# EAGLE schematic CPU (EAGLE 9.3.0)
Raspberry Pi CM3 and Associated Components
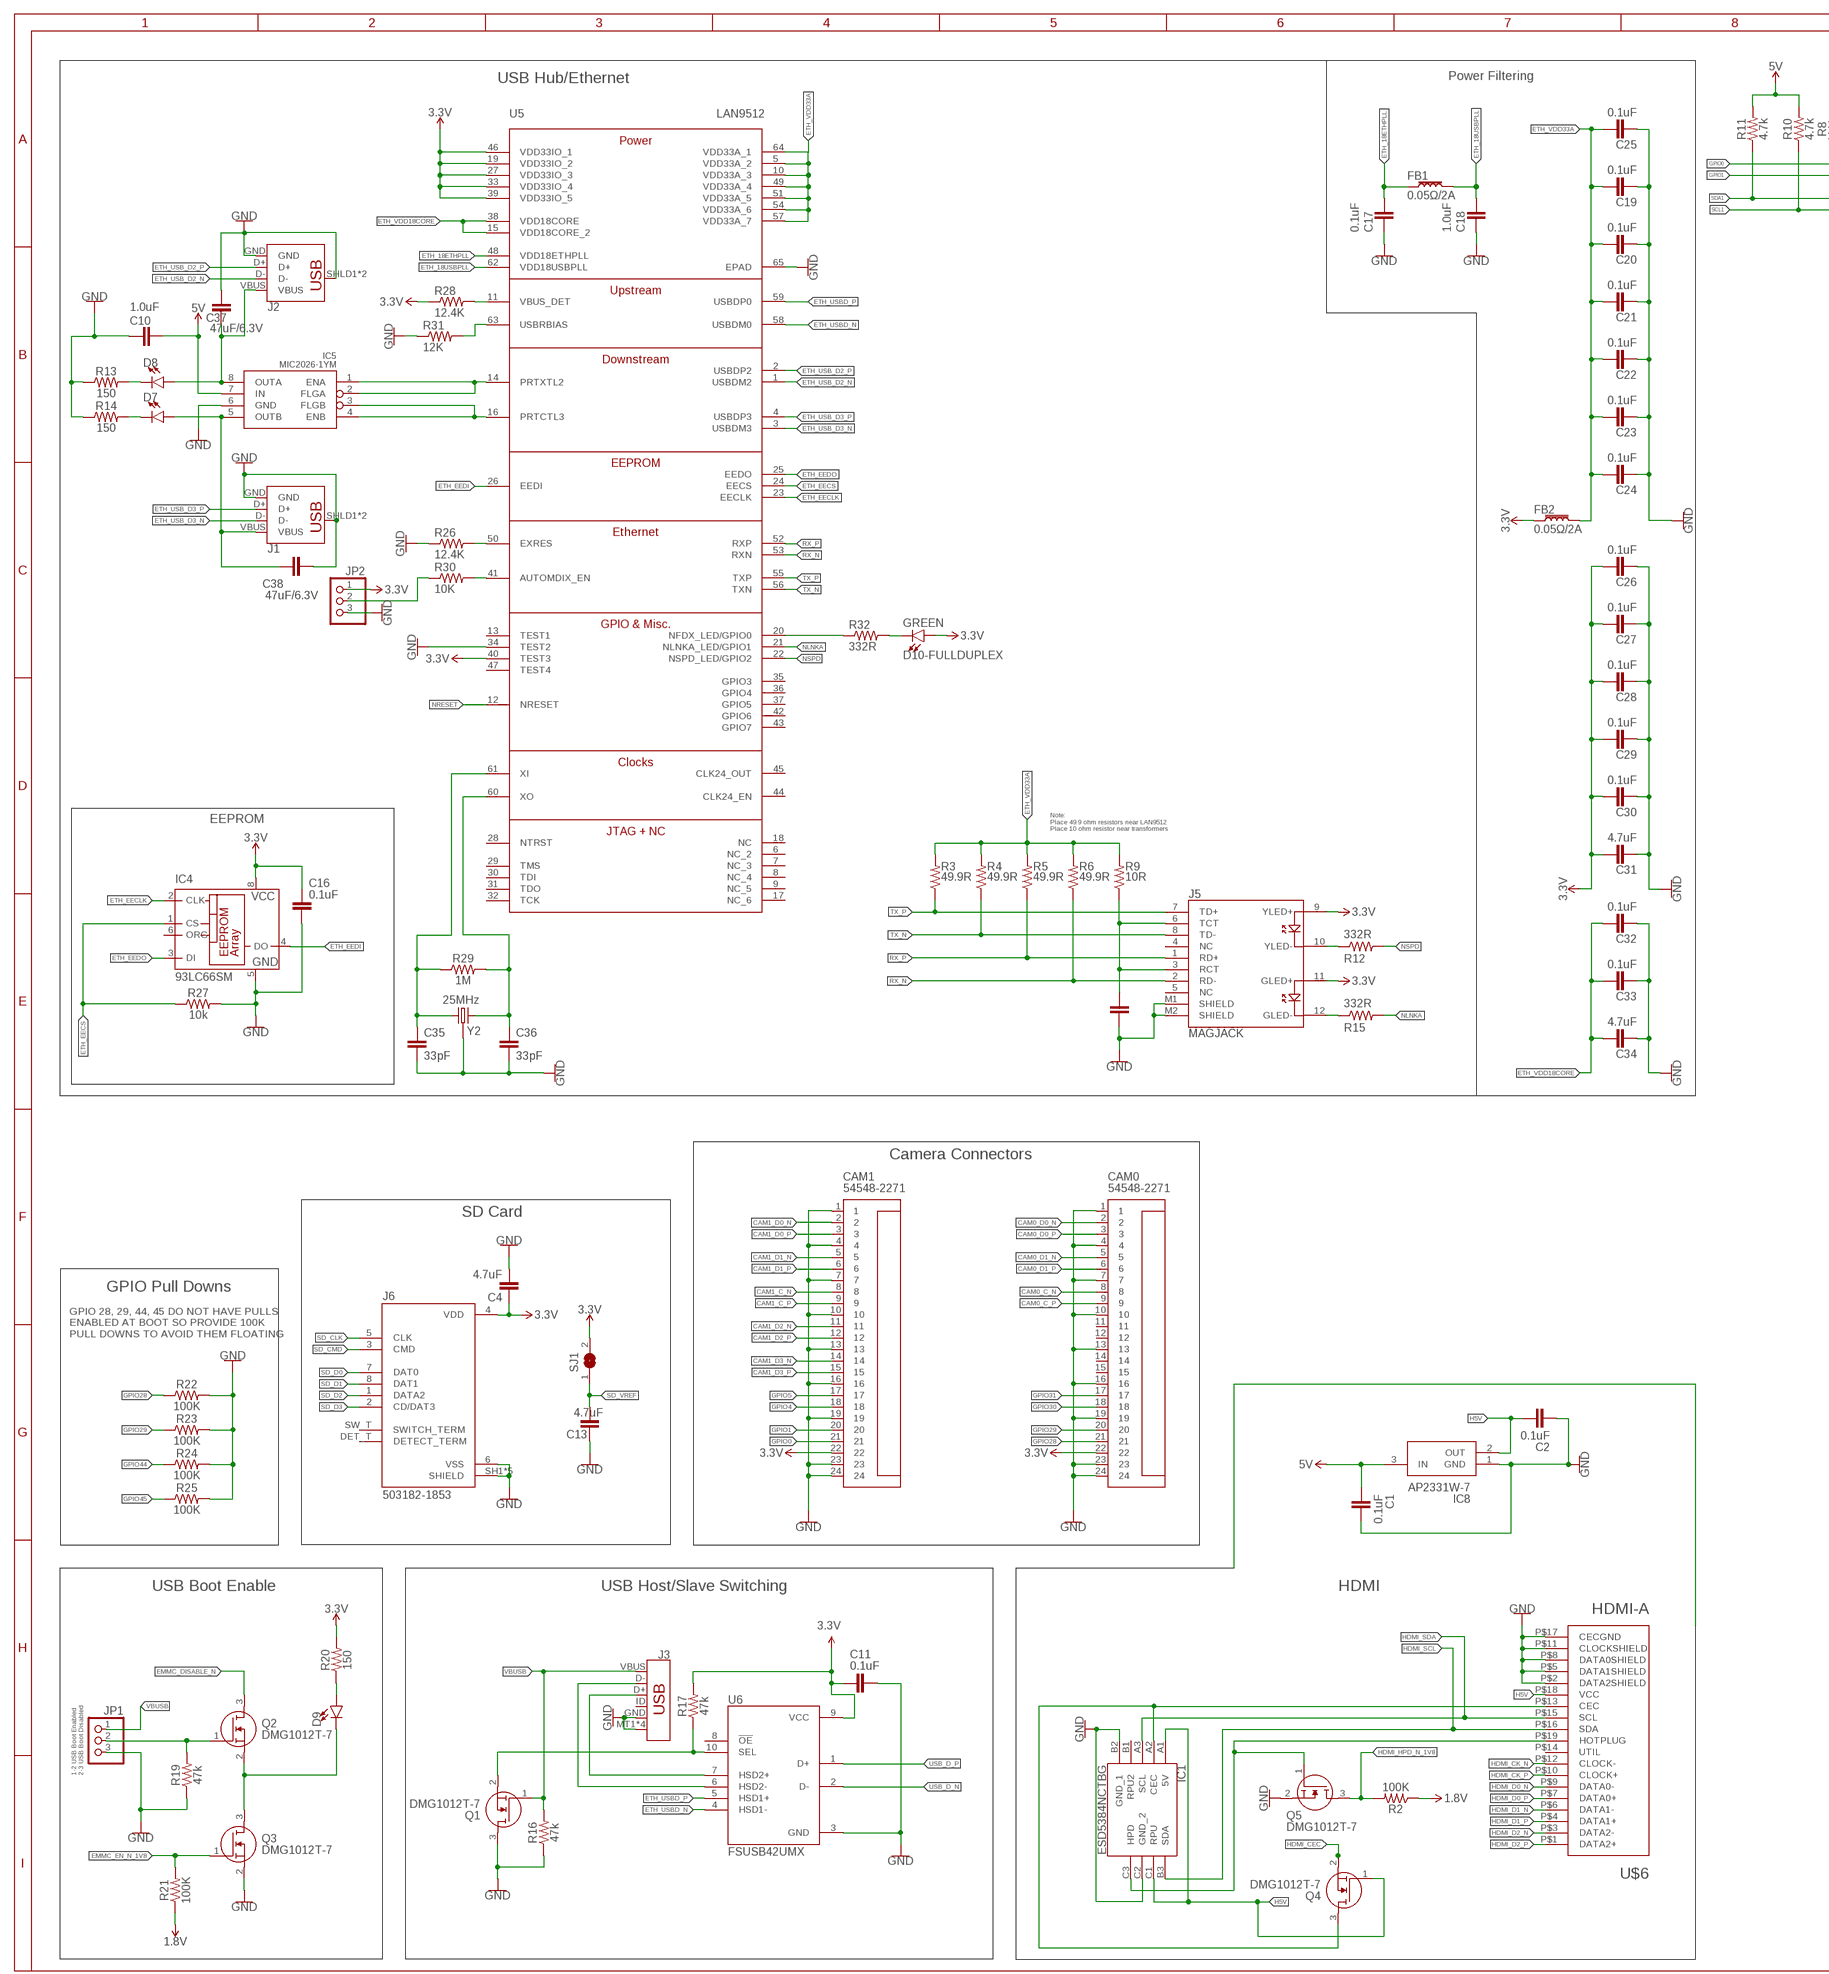
[diagram p0: schematic, sheet 1, part 1 of 2]
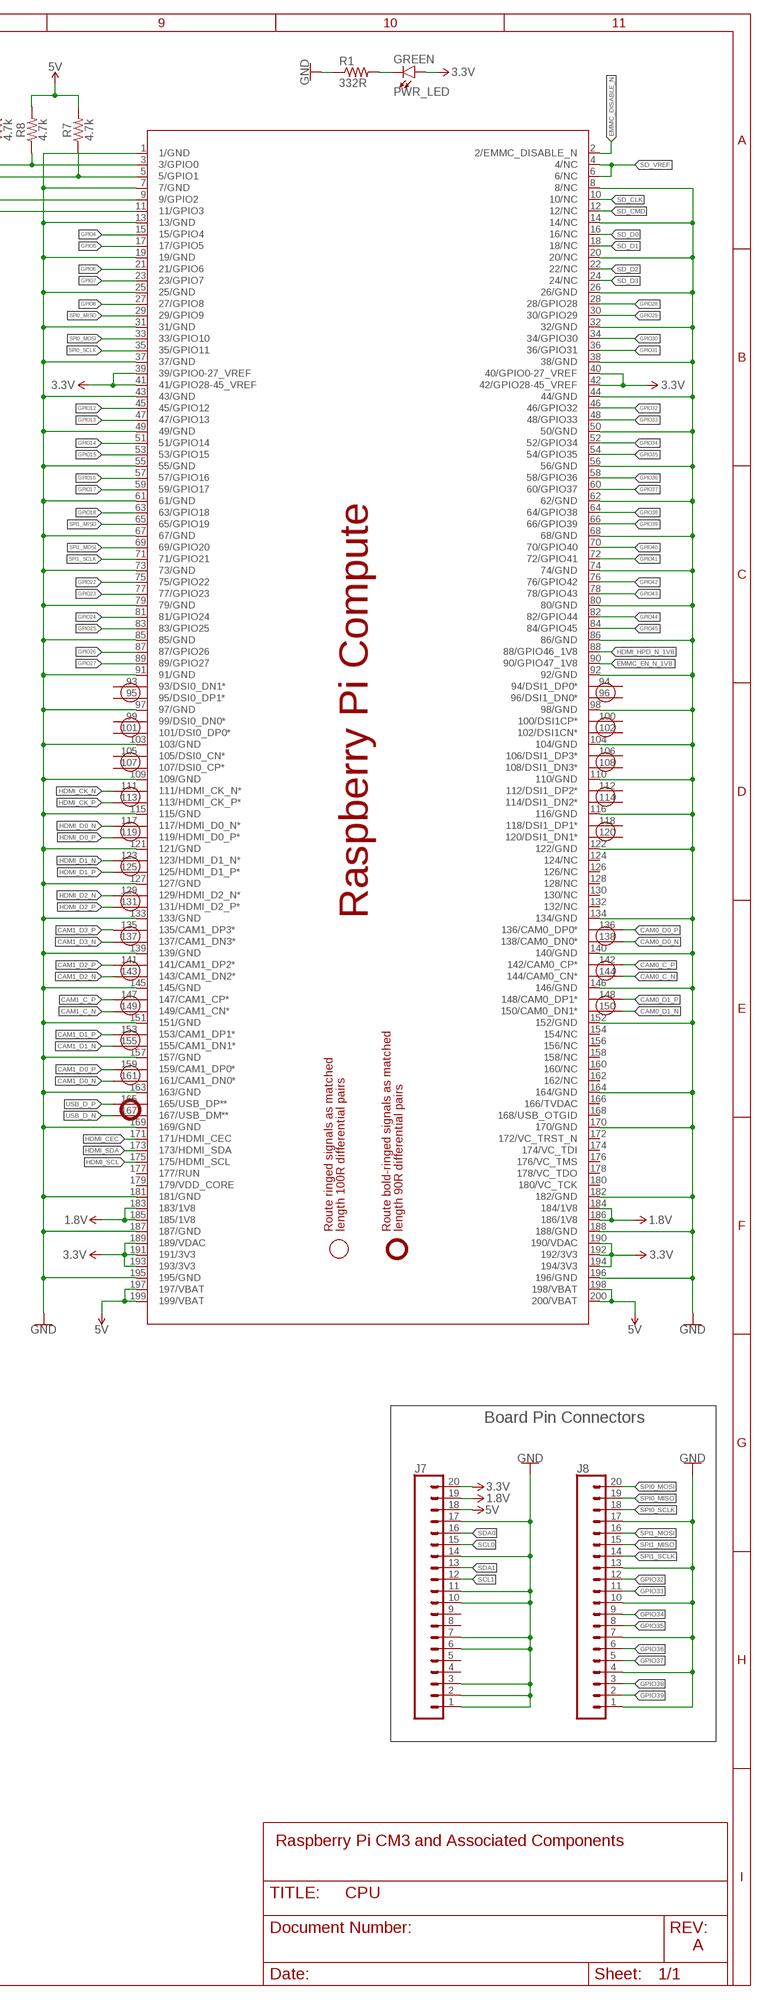
[diagram p1: schematic, sheet 1, part 2 of 2]

## Parts
C1  0.1uF  0.1UF-0402-16V-10%  [0402]
C2  0.1uF  0.1UF-0402-16V-10%  [0402]
C3  0.022uF/50V  47UF  [0805]
C4  4.7uF  4.7UF-0603-6.3V-(10%)  [0603]
C10  1.0uF  1.0UF-0402-16V-10%  [0402]
C11  0.1uF  0.1UF-0402-16V-10%  [0402]
C13  4.7uF  4.7UF-0603-6.3V-(10%)  [0603]
C16  0.1uF  0.1UF-0402-16V-10%  [0402]
C17  0.1uF  1.0UF-0402-16V-10%  [0402]
C18  1.0uF  1.0UF-0402-16V-10%  [0402]
C19  0.1uF  1.0UF-0402-16V-10%  [0402]
C20  0.1uF  1.0UF-0402-16V-10%  [0402]
C21  0.1uF  1.0UF-0402-16V-10%  [0402]
C22  0.1uF  1.0UF-0402-16V-10%  [0402]
C23  0.1uF  1.0UF-0402-16V-10%  [0402]
C24  0.1uF  1.0UF-0402-16V-10%  [0402]
C25  0.1uF  1.0UF-0402-16V-10%  [0402]
C26  0.1uF  1.0UF-0402-16V-10%  [0402]
C27  0.1uF  1.0UF-0402-16V-10%  [0402]
C28  0.1uF  1.0UF-0402-16V-10%  [0402]
C29  0.1uF  1.0UF-0402-16V-10%  [0402]
C30  0.1uF  1.0UF-0402-16V-10%  [0402]
C31  4.7uF  1.0UF-0402-16V-10%  [0402]
C32  0.1uF  1.0UF-0402-16V-10%  [0402]
C33  0.1uF  1.0UF-0402-16V-10%  [0402]
C34  4.7uF  1.0UF-0402-16V-10%  [0402]
C35  33pF  33PF-0603-50V-5%  [0603]
C36  33pF  33PF-0603-50V-5%  [0603]
C37  47uF/6.3V  47UF  [0805]
C38  47uF/6.3V  47UF  [0805]
CAM0  54548-2271  [545482271]
CAM1  54548-2271  [545482271]
CPU1  RPI_COMPUTE  [RPI_COMPUTE]
D7  GREEN  LED-GREEN0603  [LED-0603]
D8  GREEN  LED-GREEN0603  [LED-0603]
D9  GREEN  LED-GREEN0603  [LED-0603]
D10-FULLDUPLEX  GREEN  LED-GREEN0603  [LED-0603]
FB1  0.05Ω/2A  FERRITE_BEAD-0603  [0603]
FB2  0.05Ω/2A  FERRITE_BEAD-0603  [0603]
IC1  ESD5384NCTBG  [BGA9C40P3X3_114X114X63]
IC4  93LC66SM  [SO-08M]
IC5  MIC2026-1YM  [SO08]
IC8  AP2331W-7  [SOT95P285X130-3N]
J1  USB_A_SMT_FEMALE  [USB-A-S-SILK-FEMALE]
J2  USB_A_SMT_FEMALE  [USB-A-S-SILK-FEMALE]
J3  USB_MICRO-B_SMT  [USB-MICROB]
J5  MAGJACK  [MAGJACK]
J6  503182-1853  [MOLEX_503182-1853]
J7  CONN_20  [1X20]
J8  CONN_20  [1X20]
JP1  PINHD-1X3  [1X03]
JP2  PINHD-1X3  [1X03]
PWR_LED  GREEN  LED-GREEN0603  [LED-0603]
Q1  DMG1012T-7  [SOT50P160X80-3N]
Q2  DMG1012T-7  [SOT50P160X80-3N]
Q3  DMG1012T-7  [SOT50P160X80-3N]
Q4  DMG1012T-7  [SOT50P160X80-3N]
Q5  DMG1012T-7  [SOT50P160X80-3N]
R1  332R  R-US_R0603  [R0603]
R2  100K  100KOHM-0402-1/16W-1%  [0402]
R3  49.9R  R-US_R0603  [R0603]
R4  49.9R  R-US_R0603  [R0603]
R5  49.9R  R-US_R0603  [R0603]
R6  49.9R  R-US_R0603  [R0603]
R7  4.7k  4.7KOHM-0603-1/10W-1%  [0603]
R8  4.7k  4.7KOHM-0603-1/10W-1%  [0603]
R9  10R  R-US_R0603  [R0603]
R10  4.7k  4.7KOHM-0603-1/10W-1%  [0603]
R11  4.7k  4.7KOHM-0603-1/10W-1%  [0603]
R12  332R  R-US_R0603  [R0603]
R13  150  150OHM-0603-1/10W-1%  [0603]
R14  150  150OHM-0603-1/10W-1%  [0603]
R15  332R  R-US_R0603  [R0603]
R16  47k  47KOHM-0603-1/10W-1%  [0603]
R17  47k  47KOHM-0603-1/10W-1%  [0603]
R19  47k  47KOHM-0603-1/10W-1%  [0603]
R20  150  150OHM-0603-1/10W-1%  [0603]
R21  100K  100KOHM-0402-1/16W-1%  [0402]
R22  100K  100KOHM-0402-1/16W-1%  [0402]
R23  100K  100KOHM-0402-1/16W-1%  [0402]
R24  100K  100KOHM-0402-1/16W-1%  [0402]
R25  100K  100KOHM-0402-1/16W-1%  [0402]
R26  12.4K  R-US_R0603  [R0603]
R27  10k  10KOHM-0603-1/10W-1%  [0603]
R28  12.4K  R-US_R0603  [R0603]
R29  1M  1MOHM-0603-1/4W-5%  [0603]
R30  10K  R-US_R0603  [R0603]
R31  12K  R-US_R0603  [R0603]
R32  332R  R-US_R0603  [R0603]
SJ1  SJ  [SJ]
U5  LAN9512-JZX  [QFN64_9X9MC]
U6  FSUSB42UMX  [IC_FSUSB42UMX]
U$6  HDMI-A  [HDMI_A]
Y2  25MHz  CRYSTAL-GROUNDEDSMD-3.2X2.5  [CRYSTAL-SMD-3.2X2.5MM]

## Nets
1.8V [pwr]: CPU1.183(183/1V8) CPU1.184(184/1V8) CPU1.185(185/1V8) CPU1.186(186/1V8) J7.19 R2.1 R21.1
3.3V [pwr]: C4.1 C11.2 C16.1 C26.2 C27.2 C28.2 C29.2 C30.2 C31.2 CAM0.22 CAM1.22 CPU1.39(39/GPIO0-27_VREF) CPU1.40(40/GPIO0-27_VREF) CPU1.41(41/GPIO28-45_VREF) CPU1.42(42/GPIO28-45_VREF) CPU1.189(189/VDAC) CPU1.190(190/VDAC) CPU1.191(191/3V3) CPU1.192(192/3V3) CPU1.193(193/3V3) CPU1.194(194/3V3) D10-FULLDUPLEX.A FB2.1 IC4.8(VCC) J5.9(YLED+) J5.11(GLED+) J6.4(VDD) J7.20 JP2.1 PWR_LED.A R17.2 R20.2 R28.1 SJ1.2 U5.19(VDD33IO_2) U5.27(VDD33IO_3) U5.33(VDD33IO_4) U5.39(VDD33IO_5) U5.40(TEST3) U5.46(VDD33IO_1) U6.9(VCC)
5V [pwr]: C1.2 C10.2 CPU1.197(197/VBAT) CPU1.198(198/VBAT) CPU1.199(199/VBAT) CPU1.200(200/VBAT) IC5.7(IN) IC8.3(IN) J7.18 R7.2 R8.2 R10.2 R11.2
CAM0_C_N [diff pair]: CAM0.8 CPU1.144(144/CAM0_CN*)
CAM0_C_P [diff pair]: CAM0.9 CPU1.142(142/CAM0_CP*)
CAM0_D0_N [diff pair]: CAM0.2 CPU1.138(138/CAM0_DN0*)
CAM0_D0_P [diff pair]: CAM0.3 CPU1.136(136/CAM0_DP0*)
CAM0_D1_N [diff pair]: CAM0.5 CPU1.150(150/CAM0_DN1*)
CAM0_D1_P [diff pair]: CAM0.6 CPU1.148(148/CAM0_DP1*)
CAM1_C_N [diff pair]: CAM1.8 CPU1.149(149/CAM1_CN*)
CAM1_C_P [diff pair]: CAM1.9 CPU1.147(147/CAM1_CP*)
CAM1_D0_N [diff pair]: CAM1.2 CPU1.161(161/CAM1_DN0*)
CAM1_D0_P [diff pair]: CAM1.3 CPU1.159(159/CAM1_DP0*)
CAM1_D1_N [diff pair]: CAM1.5 CPU1.155(155/CAM1_DN1*)
CAM1_D1_P [diff pair]: CAM1.6 CPU1.153(153/CAM1_DP1*)
CAM1_D2_N [diff pair]: CAM1.11 CPU1.143(143/CAM1_DN2*)
CAM1_D2_P [diff pair]: CAM1.12 CPU1.141(141/CAM1_DP2*)
CAM1_D3_N [diff pair]: CAM1.14 CPU1.137(137/CAM1_DN3*)
CAM1_D3_P [diff pair]: CAM1.15 CPU1.135(135/CAM1_DP3*)
EMMC_DISABLE_N: CPU1.2(2/EMMC_DISABLE_N) Q2.3(D)
EMMC_EN_N_1V8: CPU1.90(90/GPIO47_1V8) Q3.1(G) R21.2
ETH_18ETHPLL: C17.2 FB1.1 U5.48(VDD18ETHPLL)
ETH_18USBPLL: C18.2 FB1.2 U5.62(VDD18USBPLL)
ETH_EECLK: IC4.2(CLK) U5.23(EECLK)
ETH_EECS: IC4.1(CS) R27.1 U5.24(EECS)
ETH_EEDI: IC4.4(DO) U5.26(EEDI)
ETH_EEDO: IC4.3(DI) U5.25(EEDO)
ETH_PWR2: C37.1 D8.A IC5.8(OUTA) J2.VBUS
ETH_PWR3: C38.1 D7.A IC5.5(OUTB) J1.VBUS
ETH_USB_D2_N: J2.D- U5.1(USBDM2)
ETH_USB_D2_P: J2.D+ U5.2(USBDP2)
ETH_USB_D3_N: J1.D- U5.3(USBDM3)
ETH_USB_D3_P: J1.D+ U5.4(USBDP3)
ETH_USBD_N [diff pair]: U5.58(USBDM0) U6.4(HSD1-)
ETH_USBD_P [diff pair]: U5.59(USBDP0) U6.5(HSD1+)
ETH_VDD18CORE: C32.2 C33.2 C34.2 U5.15(VDD18CORE_2) U5.38(VDD18CORE)
ETH_VDD33A: C19.2 C20.2 C21.2 C22.2 C23.2 C24.2 C25.2 FB2.2 R3.2 R4.2 R5.2 R6.2 R9.2 U5.5(VDD33A_2) U5.10(VDD33A_3) U5.49(VDD33A_4) U5.51(VDD33A_5) U5.54(VDD33A_6) U5.57(VDD33A_7) U5.64(VDD33A_1)
GND: C1.1 C2.2 C3.1 C4.2 C10.1 C11.1 C13.1 C16.2 C17.1 C18.1 C19.1 C20.1 C21.1 C22.1 C23.1 C24.1 C25.1 C26.1 C27.1 C28.1 C29.1 C30.1 C31.1 C32.1 C33.1 C34.1 C35.2 C36.2 C37.2 C38.2 CAM0.1 CAM0.4 CAM0.7 CAM0.10 CAM0.13 CAM0.16 CAM0.19 CAM0.23 CAM0.24 CAM1.1 CAM1.4 CAM1.7 CAM1.10 CAM1.13 CAM1.16 CAM1.19 CAM1.23 CAM1.24 CPU1.1(1/GND) CPU1.7(7/GND) CPU1.8(8/NC) CPU1.13(13/GND) CPU1.14(14/NC) CPU1.19(19/GND) CPU1.20(20/NC) CPU1.25(25/GND) CPU1.26(26/GND) CPU1.31(31/GND) CPU1.32(32/GND) CPU1.37(37/GND) CPU1.38(38/GND) CPU1.43(43/GND) CPU1.44(44/GND) CPU1.49(49/GND) CPU1.50(50/GND) CPU1.55(55/GND) CPU1.56(56/GND) CPU1.61(61/GND) CPU1.62(62/GND) CPU1.67(67/GND) CPU1.68(68/GND) CPU1.73(73/GND) CPU1.74(74/GND) CPU1.79(79/GND) CPU1.80(80/GND) CPU1.85(85/GND) CPU1.86(86/GND) CPU1.91(91/GND) CPU1.92(92/GND) CPU1.97(97/GND) CPU1.98(98/GND) CPU1.103(103/GND) CPU1.104(104/GND) CPU1.109(109/GND) CPU1.110(110/GND) CPU1.115(115/GND) CPU1.116(116/GND) CPU1.121(121/GND) CPU1.122(122/GND) CPU1.127(127/GND) CPU1.133(133/GND) CPU1.134(134/GND) CPU1.139(139/GND) CPU1.140(140/GND) CPU1.145(145/GND) CPU1.146(146/GND) CPU1.151(151/GND) CPU1.152(152/GND) CPU1.157(157/GND) CPU1.163(163/GND) CPU1.164(164/GND) CPU1.169(169/GND) CPU1.170(170/GND) CPU1.181(181/GND) CPU1.182(182/GND) CPU1.187(187/GND) CPU1.188(188/GND) CPU1.195(195/GND) CPU1.196(196/GND) IC1.B2(GND_1) IC1.C2(GND_2) IC4.5(GND) IC5.6(GND) IC8.1(GND) J1.GND J1.SHLD1(SHIELD) J1.SHLD2(SHIELD) J2.GND J2.SHLD1(SHIELD) J2.SHLD2(SHIELD) J3.GND J3.MT1(SHIELD) J3.MT2(SHIELD) J3.P$1(SHIELD) J3.P$2(SHIELD) J5.M1(SHIELD) J5.M2(SHIELD) J6.6(VSS) J6.SH1(SHIELD) J6.SH2(SHIELD) J6.SH3(SHIELD) J6.SH4(SHIELD) J6.SH5(SHIELD) J7.1 J7.2 J7.3 J7.6 J7.7 J7.10 J7.11 J7.14 J7.17 J8.1 J8.4 J8.7 J8.10 J8.13 J8.17 JP1.3 JP2.3 Q1.3(D) Q3.2(S) Q5.2(S) R1.1 R13.1 R14.1 R16.1 R19.1 R22.2 R23.2 R24.2 R25.2 R26.1 R27.2 R31.1 U5.34(TEST2) U5.65(EPAD) U6.3(GND) U$6.P$2(DATA2SHIELD) U$6.P$5(DATA1SHIELD) U$6.P$8(DATA0SHIELD) U$6.P$11(CLOCKSHIELD) U$6.P$17(CECGND) Y2.2 Y2.4
GPIO0: CAM1.21 CPU1.3(3/GPIO0) R8.1
GPIO1: CAM1.20 CPU1.5(5/GPIO1) R7.1
GPIO4: CAM1.18 CPU1.15(15/GPIO4)
GPIO5: CAM1.17 CPU1.17(17/GPIO5)
GPIO6: CPU1.21(21/GPIO6)
GPIO7: CPU1.23(23/GPIO7)
GPIO8: CPU1.27(27/GPIO8)
GPIO12: CPU1.45(45/GPIO12)
GPIO13: CPU1.47(47/GPIO13)
GPIO14: CPU1.51(51/GPIO14)
GPIO15: CPU1.53(53/GPIO15)
GPIO16: CPU1.57(57/GPIO16)
GPIO17: CPU1.59(59/GPIO17)
GPIO18: CPU1.63(63/GPIO18)
GPIO22: CPU1.75(75/GPIO22)
GPIO23: CPU1.77(77/GPIO23)
GPIO24: CPU1.81(81/GPIO24)
GPIO25: CPU1.83(83/GPIO25)
GPIO26: CPU1.87(87/GPIO26)
GPIO27: CPU1.89(89/GPIO27)
GPIO28: CAM0.21 CPU1.28(28/GPIO28) R22.1
GPIO29: CAM0.20 CPU1.30(30/GPIO29) R23.1
GPIO30: CAM0.18 CPU1.34(34/GPIO30)
GPIO31: CAM0.17 CPU1.36(36/GPIO31)
GPIO32: CPU1.46(46/GPIO32) J8.12
GPIO33: CPU1.48(48/GPIO33) J8.11
GPIO34: CPU1.52(52/GPIO34) J8.9
GPIO35: CPU1.54(54/GPIO35) J8.8
GPIO36: CPU1.58(58/GPIO36) J8.6
GPIO37: CPU1.60(60/GPIO37) J8.5
GPIO38: CPU1.64(64/GPIO38) J8.3
GPIO39: CPU1.66(66/GPIO39) J8.2
GPIO40: CPU1.70(70/GPIO40)
GPIO41: CPU1.72(72/GPIO41)
GPIO42: CPU1.76(76/GPIO42)
GPIO43: CPU1.78(78/GPIO43)
GPIO44: CPU1.82(82/GPIO44) R24.1
GPIO45: CPU1.84(84/GPIO45) R25.1
H5V [bga]: C2.1 IC1.A1(5V) IC1.C1(RPU) IC8.2(OUT) Q4.1(G) U$6.P$18(VCC)
HDMI_CEC: CPU1.171(171/HDMI_CEC) Q4.2(S)
HDMI_CK_N: CPU1.111(111/HDMI_CK_N*) U$6.P$12(CLOCK-)
HDMI_CK_P: CPU1.113(113/HDMI_CK_P*) U$6.P$10(CLOCK+)
HDMI_D0_N: CPU1.117(117/HDMI_D0_N*) U$6.P$9(DATA0-)
HDMI_D0_P: CPU1.119(119/HDMI_D0_P*) U$6.P$7(DATA0+)
HDMI_D1_N: CPU1.123(123/HDMI_D1_N*) U$6.P$6(DATA1-)
HDMI_D1_P: CPU1.125(125/HDMI_D1_P*) U$6.P$4(DATA1+)
HDMI_D2_N: CPU1.129(129/HDMI_D2_N*) U$6.P$3(DATA2-)
HDMI_D2_P: CPU1.131(131/HDMI_D2_P*) U$6.P$1(DATA2+)
HDMI_HPD_N_1V8: CPU1.88(88/GPIO46_1V8) Q5.3(D) R2.2
HDMI_SCL [bga]: CPU1.175(175/HDMI_SCL) IC1.B3(SDA) U$6.P$16(SDA)
HDMI_SDA [bga]: CPU1.173(173/HDMI_SDA) IC1.A3(SCL) U$6.P$15(SCL)
N$1: PWR_LED.C R1.2
N$3: C3.2 J5.3(RCT) J5.6(TCT) R9.1
N$4: R26.2 U5.50(EXRES)
N$5: R28.2 U5.11(VBUS_DET)
N$6 [bga]: IC1.C3(HPD) Q5.1(G) U$6.P$19(HOTPLUG)
N$7: C35.1 R29.1 U5.61(XI) Y2.1
N$8: C36.1 R29.2 U5.60(XO) Y2.3
N$9 [bga]: IC1.A2(CEC) Q4.3(D) U$6.P$13(CEC)
N$10: IC5.1(ENA) IC5.2(FLGA) U5.14(PRTXTL2)
N$11: IC5.3(FLGB) IC5.4(ENB) U5.16(PRTCTL3)
N$12: J5.10(YLED-) R12.1
N$13: R30.2 U5.41(AUTOMDIX_EN)
N$14: JP2.2 R30.1
N$15: J5.12(GLED-) R15.1
N$16: D8.C R13.2
N$17: D7.C R14.2
N$18 [bga]: J3.D+ U6.7(HSD2+)
N$19: Q1.2(S) R17.1 U6.10(SEL)
N$20 [bga]: J3.D- U6.6(HSD2-)
N$21: JP1.2 Q2.1(G) R19.2
N$22: D9.C Q2.2(S) Q3.3(D)
N$23: D9.A R20.1
N$24: R31.2 U5.63(USBRBIAS)
N$26: D10-FULLDUPLEX.C R32.2
N$28: R32.1 U5.20(NFDX_LED/GPIO0)
NLNKA: R15.2 U5.21(NLNKA_LED/GPIO1)
NRESET: U5.12(NRESET)
NSPD: R12.2 U5.22(NSPD_LED/GPIO2)
RX_N [diff pair]: J5.2(RD-) R6.1 U5.53(RXN)
RX_P [diff pair]: J5.1(RD+) R5.1 U5.52(RXP)
SCL0: J7.15
SCL1: CPU1.11(11/GPIO3) J7.12 R10.1
SD_CLK: CPU1.10(10/NC) J6.5(CLK)
SD_CMD: CPU1.12(12/NC) J6.3(CMD)
SD_D0: CPU1.16(16/NC) J6.7(DAT0)
SD_D1: CPU1.18(18/NC) J6.8(DAT1)
SD_D2: CPU1.22(22/NC) J6.1(DATA2)
SD_D3: CPU1.24(24/NC) J6.2(CD/DAT3)
SD_VREF: C13.2 CPU1.4(4/NC) CPU1.6(6/NC) SJ1.1
SDA0: J7.16
SDA1: CPU1.9(9/GPIO2) J7.13 R11.1
SPI0_MISO: CPU1.29(29/GPIO9) J8.19
SPI0_MOSI: CPU1.33(33/GPIO10) J8.20
SPI0_SCLK: CPU1.35(35/GPIO11) J8.18
SPI1_MISO: CPU1.65(65/GPIO19) J8.15
SPI1_MOSI: CPU1.69(69/GPIO20) J8.16
SPI1_SCLK: CPU1.71(71/GPIO21) J8.14
TX_N [diff pair]: J5.8(TD-) R4.1 U5.56(TXN)
TX_P [diff pair]: J5.7(TD+) R3.1 U5.55(TXP)
USB_D_N [diff pair]: CPU1.167(167/USB_DM**) U6.2(D-)
USB_D_P [diff pair]: CPU1.165(165/USB_DP**) U6.1(D+)
VBUSB: J3.VBUS JP1.1 Q1.1(G) R16.2
Unconnected: CAM0.11 CAM0.12 CAM0.14 CAM0.15 CPU1.93(93/DSI0_DN1*) CPU1.94(94/DSI1_DP0*) CPU1.95(95/DSI0_DP1*) CPU1.96(96/DSI1_DN0*) CPU1.99(99/DSI0_DN0*) CPU1.100(100/DSI1CP*) CPU1.101(101/DSI0_DP0*) CPU1.102(102/DSI1CN*) CPU1.105(105/DSI0_CN*) CPU1.106(106/DSI1_DP3*) CPU1.107(107/DSI0_CP*) CPU1.108(108/DSI1_DN3*) CPU1.112(112/DSI1_DP2*) CPU1.114(114/DSI1_DN2*) CPU1.118(118/DSI1_DP1*) CPU1.120(120/DSI1_DN1*) CPU1.124(124/NC) CPU1.126(126/NC) CPU1.128(128/NC) CPU1.130(130/NC) CPU1.132(132/NC) CPU1.154(154/NC) CPU1.156(156/NC) CPU1.158(158/NC) CPU1.160(160/NC) CPU1.162(162/NC) CPU1.166(166/TVDAC) CPU1.168(168/USB_OTGID) CPU1.172(172/VC_TRST_N) CPU1.174(174/VC_TDI) CPU1.176(176/VC_TMS) CPU1.177(177/RUN) CPU1.178(178/VC_TDO) CPU1.179(179/VDD_CORE) CPU1.180(180/VC_TCK) IC1.B1(RPU2) IC4.6(ORG) IC4.7(NU) J3.ID J5.4(NC) J5.5(NC) J6.DET_T(DETECT_TERM) J6.SW_T(SWITCH_TERM) J7.4 J7.5 J7.8 J7.9 U5.6(NC_2) U5.7(NC_3) U5.8(NC_4) U5.9(NC_5) U5.13(TEST1) U5.17(NC_6) U5.18(NC) U5.28(NTRST) U5.29(TMS) U5.30(TDI) U5.31(TDO) U5.32(TCK) U5.35(GPIO3) U5.36(GPIO4) U5.37(GPIO5) U5.42(GPIO6) U5.43(GPIO7) U5.44(CLK24_EN) U5.45(CLK24_OUT) U5.47(TEST4) U6.8(!OE) U$6.P$14(UTIL)

## Notes on the sheet
- Power Filtering
- USB Hub/Ethernet
- LAN9512
- EEPROM
- Note:
  Place 49.9 ohm resistors near LAN9512
  Place 10 ohm resistor near transformers
- Camera Connectors
- SD Card
- GPIO Pull Downs
- GPIO 28, 29, 44, 45 DO NOT HAVE PULLS
  ENABLED AT BOOT SO PROVIDE 100K 
  PULL DOWNS TO AVOID THEM FLOATING
- Board Pin Connectors
- USB Boot Enable | USB Host/Slave Switching | HDMI
- 1-2 USB Boot Enabled
  2-3 USB Boot Disabled
- Raspberry Pi CM3 and Associated Components
- A

## Library data of the parts
C1 C2 C11 C16 = SparkFun-Capacitors:0.1UF: 0.1µF ceramic capacitors A capacitor is a passive two-terminal electrical component used to store electrical energy temporarily in an electric field.; PROD_ID: CAP-12416
C3 = SparkFun-Capacitors:47UF; PROD_ID: CAP-13854; VALUE: 47uF/6.3V
C4 C13 = SparkFun-Capacitors:4.7UF: 4.7µF ceramic capacitors A capacitor is a passive two-terminal electrical component used to store electrical energy temporarily in an electric field.; PROD_ID: CAP-08280
C10 C18 = SparkFun-Capacitors:1.0UF: 1µF ceramic capacitors A capacitor is a passive two-terminal electrical component used to store electrical energy temporarily in an electric field.; PROD_ID: CAP-12417
C17 C19-C34 = SparkFun-Capacitors:1.0UF: 1µF ceramic capacitors A capacitor is a passive two-terminal electrical component used to store electrical energy temporarily in an electric field.; PROD_ID: CAP-12417; VALUE: 1.0uF
C35 C36 = SparkFun-Capacitors:33PF: 33pF ceramic capacitors A capacitor is a passive two-terminal electrical component used to store electrical energy temporarily in an electric field.; PROD_ID: CAP-10142
C37 C38 = SparkFun-Capacitors:47UF; PROD_ID: CAP-13854
CAM0 CAM1 = SamacSys_Parts:54548-2271: FFC & FPC Connectors 0.5 FPC ZIF Hsg Assy ssy 22Ckt EmbsTp Pkg Source: Datasheet <https://componentsearchengine.com/Datasheets/1/54548-2271.pdf>; DESCRIPTION: FFC & FPC Connectors 0.5 FPC ZIF Hsg Assy ssy 22Ckt EmbsTp Pkg; HEIGHT: 1mm; MANUFACTURER_NAME: Molex; MANUFACTURER_PART_NUMBER: 54548-2271; MOUSER_PART_NUMBER: 538-54548-2271
CPU1 = e14_Rpi_Compute_RevC:RPI_COMPUTE: Device for a Raspberry PI Compute module. Note that the package is for a DDR2 connector of 'standard' orientation. Example: TE Connectivity P/N: 1565917-4, Newark P/N: 08P0616, Farnell P/N: 2112525 More information is available at http://www.element14.com/community/community/raspberry-pi/raspberry-pi-compute-module
D7-D9 D10-FULLDUPLEX PWR_LED = SparkFun-LED:LED-GREEN: Green SMD LED Used in manufacturing of various products at SparkFun Packages: 0603 - SMD 0603 package [Product Link] <http://www.futureelectronics.com/en/technologies/semiconductors/optoelectronics/leds/Pages/9894312-LTST-C190GKT.aspx?CrossPart=HSMG-C190&IM=0> LilyPad 1206 - SMD1206 LilyPad package [Product Link] <http://www.futureelectronics.com/en/Technologies/Product.aspx?ProductID=IN150NGHARVATEKCORPORATION2049943&IM=0> 1206 - SMD1206 package [Product Link] <http://www.futureelectronics.com/en/technologies/semiconductors/optoelectronics/leds/Pages/8315665-LTST-C150KGKT.aspx?IM=0> 1206 Bottom Mount -SMD 1206 Bottom Mount [Product Link] <http://www.digikey.com/product-detail/en/lite-on-inc/LTST-C230KGKT/160-1456-1-ND/386854> SparkFun Products: Pro Mini 328 -5V <https://www.sparkfun.com/products/821> RedBoard <https://www.sparkfun.com/products/12757> MP3 Trigger <https://www.sparkfun.com/products/13720> Makey Makey <https://www.sparkfun.com/products/11076>; PROD_ID: DIO-00821
FB1 FB2 = SparkFun-Coils:FERRITE_BEAD: Ferrite Bead (blocks, cores, rings, chokes, etc.) Inductor with layers of ferrite used to suppress high frequencies. Often used to isolate high frequency noise. SparkFun Products: IOIO-OTG - V2.2 <https://www.sparkfun.com/products/13613> SparkFun SAMD21 Mini Breakout <https://www.sparkfun.com/products/13664> SparkFun 6 Degrees of Freedom Breakout - LSM6DS3 <https://www.sparkfun.com/products/13339> SparkFun SAMD21 Dev Breakout <https://www.sparkfun.com/products/13672>; PROD_ID: NDUC-13805; VALUE: 30Ω/1.8A
IC1 = SamacSys_Parts:ESD5384NCTBG: Source: Datasheet <https://componentsearchengine.com/Datasheets/1/ESD5384NCTBG.pdf>; HEIGHT: 0.63mm; MANUFACTURER_NAME: ON Semiconductor; MANUFACTURER_PART_NUMBER: ESD5384NCTBG; MOUSER_PART_NUMBER: 863-ESD5384NCTBG
IC4 = microchip:93*: Serial EPROM 1 K/2 K/4 K, low voltage, Microwire; MF: MICROCHIP; MPN: 93LC66/SN; OC_FARNELL: 1296586; OC_NEWARK: 65K1154
IC5 = micrel:MIC2026*-1Y: Dual-Channel Power Distribution Switch
IC8 = SamacSys_Parts:AP2331W-7: DiodesZetex AP2331W-7 Load Switch IC, Load Switch, 0.2A, 2.7 5.2V, 3-Pin, SC-59 Source: Datasheet <https://componentsearchengine.com/Datasheets/1/AP2331W-7.pdf>; DESCRIPTION: DiodesZetex AP2331W-7 Load Switch IC, Load Switch, 0.2A, 2.7 5.2V, 3-Pin, SC-59; HEIGHT: 1.3mm; MANUFACTURER_NAME: Diodes Inc.; MANUFACTURER_PART_NUMBER: AP2331W-7; MOUSER_PART_NUMBER: 621-AP2331W-7
J1 J2 = SparkFun-Connectors:USB_A: USB-A Connector Male and female variants, as well as PTH and SMT variants SparkFun Products: SparkFun XBee Explorer Dongle <https://www.sparkfun.com/products/11697> PTH Male SparkFun MicroView-USB Programmer <https://www.sparkfun.com/products/12924> SMT Male SparkFun USB Type A Female Breakout <https://www.sparkfun.com/products/12700> SMT Female; PROD_ID: CONN-09520; SF_ID: PRT-09011
J3 = SparkFun-Connectors:USB_MICRO-B: USB Type Micro-B Connector Male/female and PTH/SMT variants SparkFun Products: SparkFun microB USB Breakout <https://www.sparkfun.com/products/12035> SparkFun USB microB Plug Breakout <https://www.sparkfun.com/products/10031> SparkFun ESP8266 Thing <https://www.sparkfun.com/products/13231>; PROD_ID: CONN-09505; SF_ID: PRT-08533
J5 = SparkFun-Connectors:MAGJACK: MAGJACK: RJ-45 with LEDs This is a single port, RJ45 ethernet jacks with built in transformer (magnetics), status LEDs, and shielding. Here is the connector we sell at SparkFun: RJ45 Ethernet MagJack-Compatible <https://www.sparkfun.com/products/8534> (PRT-08534) Datasheet <http://www.sparkfun.com/datasheets/Prototyping/MagJack.pdf> It is used on this SparkFun product: SparkFun RJ45 MagJack Breakout <https://www.sparkfun.com/products/13021> (BOB-13021); PROD_ID: CONN-09556; SF_ID: PRT-08534
J6 = 503182-1853:503182-1853: Conn Micro SD Card SKT 8 POS 1.09mm Solder RA SMD Embossed T/R 0.5A/Contact; DESCRIPTION: Conn Micro SD Card SKT 8 POS 1.09mm Solder RA SMD Embossed T/R 0.5A/Contact; DIGI-KEY_PART_NUMBER: WM9750CT-ND; DIGI-KEY_PURCHASE_URL: https://www.digikey.com/product-detail/en/molex/5031821853/WM9750CT-ND/4092575?utm_source=snapeda&utm_medium=aggregator&utm_campaign=symbol; MF: Molex; MP: 5031821853; PACKAGE: None
J7 J8 = SparkFun-Connectors:CONN_20: Multi connection point. Often used as Generic Header-pin footprint for 0.1 inch spaced/style header connections On any of the 0.1 inch spaced packages, you can populate with these: Break Away Headers - Straight <https://www.sparkfun.com/products/116> (PRT-00116) Break Away Male Headers - Right Angle <https://www.sparkfun.com/products/553> (PRT-00553) Female Headers <https://www.sparkfun.com/products/115> (PRT-00115) Break Away Headers - Machine Pin <https://www.sparkfun.com/products/117> (PRT-00117) Break Away Female Headers - Swiss Machine Pin <https://www.sparkfun.com/products/743> (PRT-00743) For SCREWTERMINALS and SPRING TERMINALS visit here: Screw Terimnals on SparkFun.com <https://www.sparkfun.com/search/results?term=Screw+Terminals> (5mm/3.5mm/2.54mm spacing) This device is also useful as a general connection point to wire up your design to another part of your project. Our various solder wires solder well into these plated through hole pads. Hook-Up Wire - Assortment (Stranded, 22 AWG) <https://www.sparkfun.com/products/11375> (PRT-11375) Hook-Up Wire - Assortment (Solid Core, 22 AWG) <https://www.sparkfun.com/products/11367> (PRT-11367) View the entire wire category on our website here <https://www.sparkfun.com/categories/141> Special notes: Molex polarized connector foot print use with SKU : PRT-08231 with associated crimp pins and housings. 1MM SMD Version SKU: PRT-10208 NOTES ON THE VARIANTS LOCK and LOCK_LONGPADS... This footprint was designed to help hold the alignment of a through-hole component (i.e. 6-pin header) while soldering it into place. You may notice that each hole has been shifted either up or down by 0.005 of an inch from it's more standard position (which is a perfectly straight line). This slight alteration caused the pins (the squares in the middle) to touch the edges of the holes. Because they are alternating, it causes a "brace" to hold the component in place. 0.005 has proven to be the perfect amount of "off-center" position when using our standard breakaway headers. Although looks a little odd when you look at the bare footprint, once you have a header in there, the alteration is very hard to notice. Also,if you push a header all the way into place, it is covered up entirely on the bottom side. Note about LOCK SPECIAL package: This is just like the LOCK variant in that the holes are staggared by 5 mil, but except for the last two holes. They are not altered from the "standard" footprint layout. This is used for a special purpose on the layout of our Graphic LCD Backpack. Make sure you want to use this device before selecting it for you project!
JP1 JP2 = adafruit:PINHD-1X3: PIN HEADER
Q1-Q5 = SamacSys_Parts:DMG1012T-7: MOSFET N-Channel 20V 0.63A SOT523 Diodes Inc DMG1012T-7 N-channel MOSFET Transistor, 0.63 A, 20 V, 3-Pin SOT-523 Source: Datasheet <https://componentsearchengine.com/Datasheets/1/DMG1012T-7.pdf>; DESCRIPTION: MOSFET N-Channel 20V 0.63A SOT523 Diodes Inc DMG1012T-7 N-channel MOSFET Transistor, 0.63 A, 20 V, 3-Pin SOT-523; HEIGHT: 0.8mm; MANUFACTURER_NAME: Diodes Inc.; MANUFACTURER_PART_NUMBER: DMG1012T-7; MOUSER_PART_NUMBER: 621-DMG1012T-7
R1 R3-R6 R9 R12 R15 R26 R28 R30-R32 = adafruit:R-US_: RESISTOR, American symbol
R2 R21-R25 = SparkFun-Resistors:100KOHM: 100kΩ resistor A resistor is a passive two-terminal electrical component that implements electrical resistance as a circuit element. Resistors act to reduce current flow, and, at the same time, act to lower voltage levels within circuits. - Wikipedia; PROD_ID: RES-13495
R7 R8 R10 R11 = SparkFun-Resistors:4.7KOHM: 4.7kΩ resistor A resistor is a passive two-terminal electrical component that implements electrical resistance as a circuit element. Resistors act to reduce current flow, and, at the same time, act to lower voltage levels within circuits. - Wikipedia; PROD_ID: RES-07857
R13 R14 R20 = SparkFun-Resistors:150OHM: 150Ω resistor A resistor is a passive two-terminal electrical component that implements electrical resistance as a circuit element. Resistors act to reduce current flow, and, at the same time, act to lower voltage levels within circuits. - Wikipedia; PROD_ID: RES-11028
R16 R17 R19 = SparkFun-Resistors:47KOHM: 47kΩ resistor A resistor is a passive two-terminal electrical component that implements electrical resistance as a circuit element. Resistors act to reduce current flow, and, at the same time, act to lower voltage levels within circuits. - Wikipedia; PROD_ID: RES-07871
R27 = SparkFun-Resistors:10KOHM: 10kΩ resistor A resistor is a passive two-terminal electrical component that implements electrical resistance as a circuit element. Resistors act to reduce current flow, and, at the same time, act to lower voltage levels within circuits. - Wikipedia; PROD_ID: RES-00824
R29 = SparkFun-Resistors:1MOHM: 1MΩ resistor A resistor is a passive two-terminal electrical component that implements electrical resistance as a circuit element. Resistors act to reduce current flow, and, at the same time, act to lower voltage levels within circuits. - Wikipedia; PROD_ID: RES-07868
SJ1 = jumper:SJ: SMD solder JUMPER
U5 = External:LAN9512-JZX; MANUFACTURER_PART_NUMBER: LAN9512JZX; VENDOR: Microchip
U6 = FSUSB42UMX:FSUSB42UMX: FSUSB42 Series DPDT 4.3 V 480 Mbps SMT Hi Speed USB 2.0 Switch - UMLP-10; DESCRIPTION: FSUSB42 Series DPDT 4.3 V 480 Mbps SMT Hi Speed USB 2.0 Switch - UMLP-10; DIGI-KEY_PART_NUMBER: FSUSB42UMXCT-ND; DIGI-KEY_PURCHASE_URL: https://www.digikey.com/product-detail/en/on-semiconductor/FSUSB42UMX/FSUSB42UMXCT-ND/1642629?utm_source=snapeda&utm_medium=aggregator&utm_campaign=symbol; MF: ON Semiconductor; MP: FSUSB42UMX; PACKAGE: UFQFN-10 ON Semiconductor
U$6 = connectors:HDMI-A: Horizonal HDMI type "A" jack
Y2 = SparkFun-Clocks:CRYSTAL-GROUNDED: Crystals w/ Ground Pin (Generic) These are passive quartz crystals, which can be used as a clock source for a microcontroller. Crystal's are usually two-terminal devices. A third terminal may be optionally connected to ground, as recommended by the manufaturer.

## Net classes
0 default: width 0.254 mm
1 diff pair: width 0.254 mm
2 pwr: width 0.305 mm
3 bga: width 0.152 mm